# Altium schematic sheet 发送端原理图.SchDoc
size A3
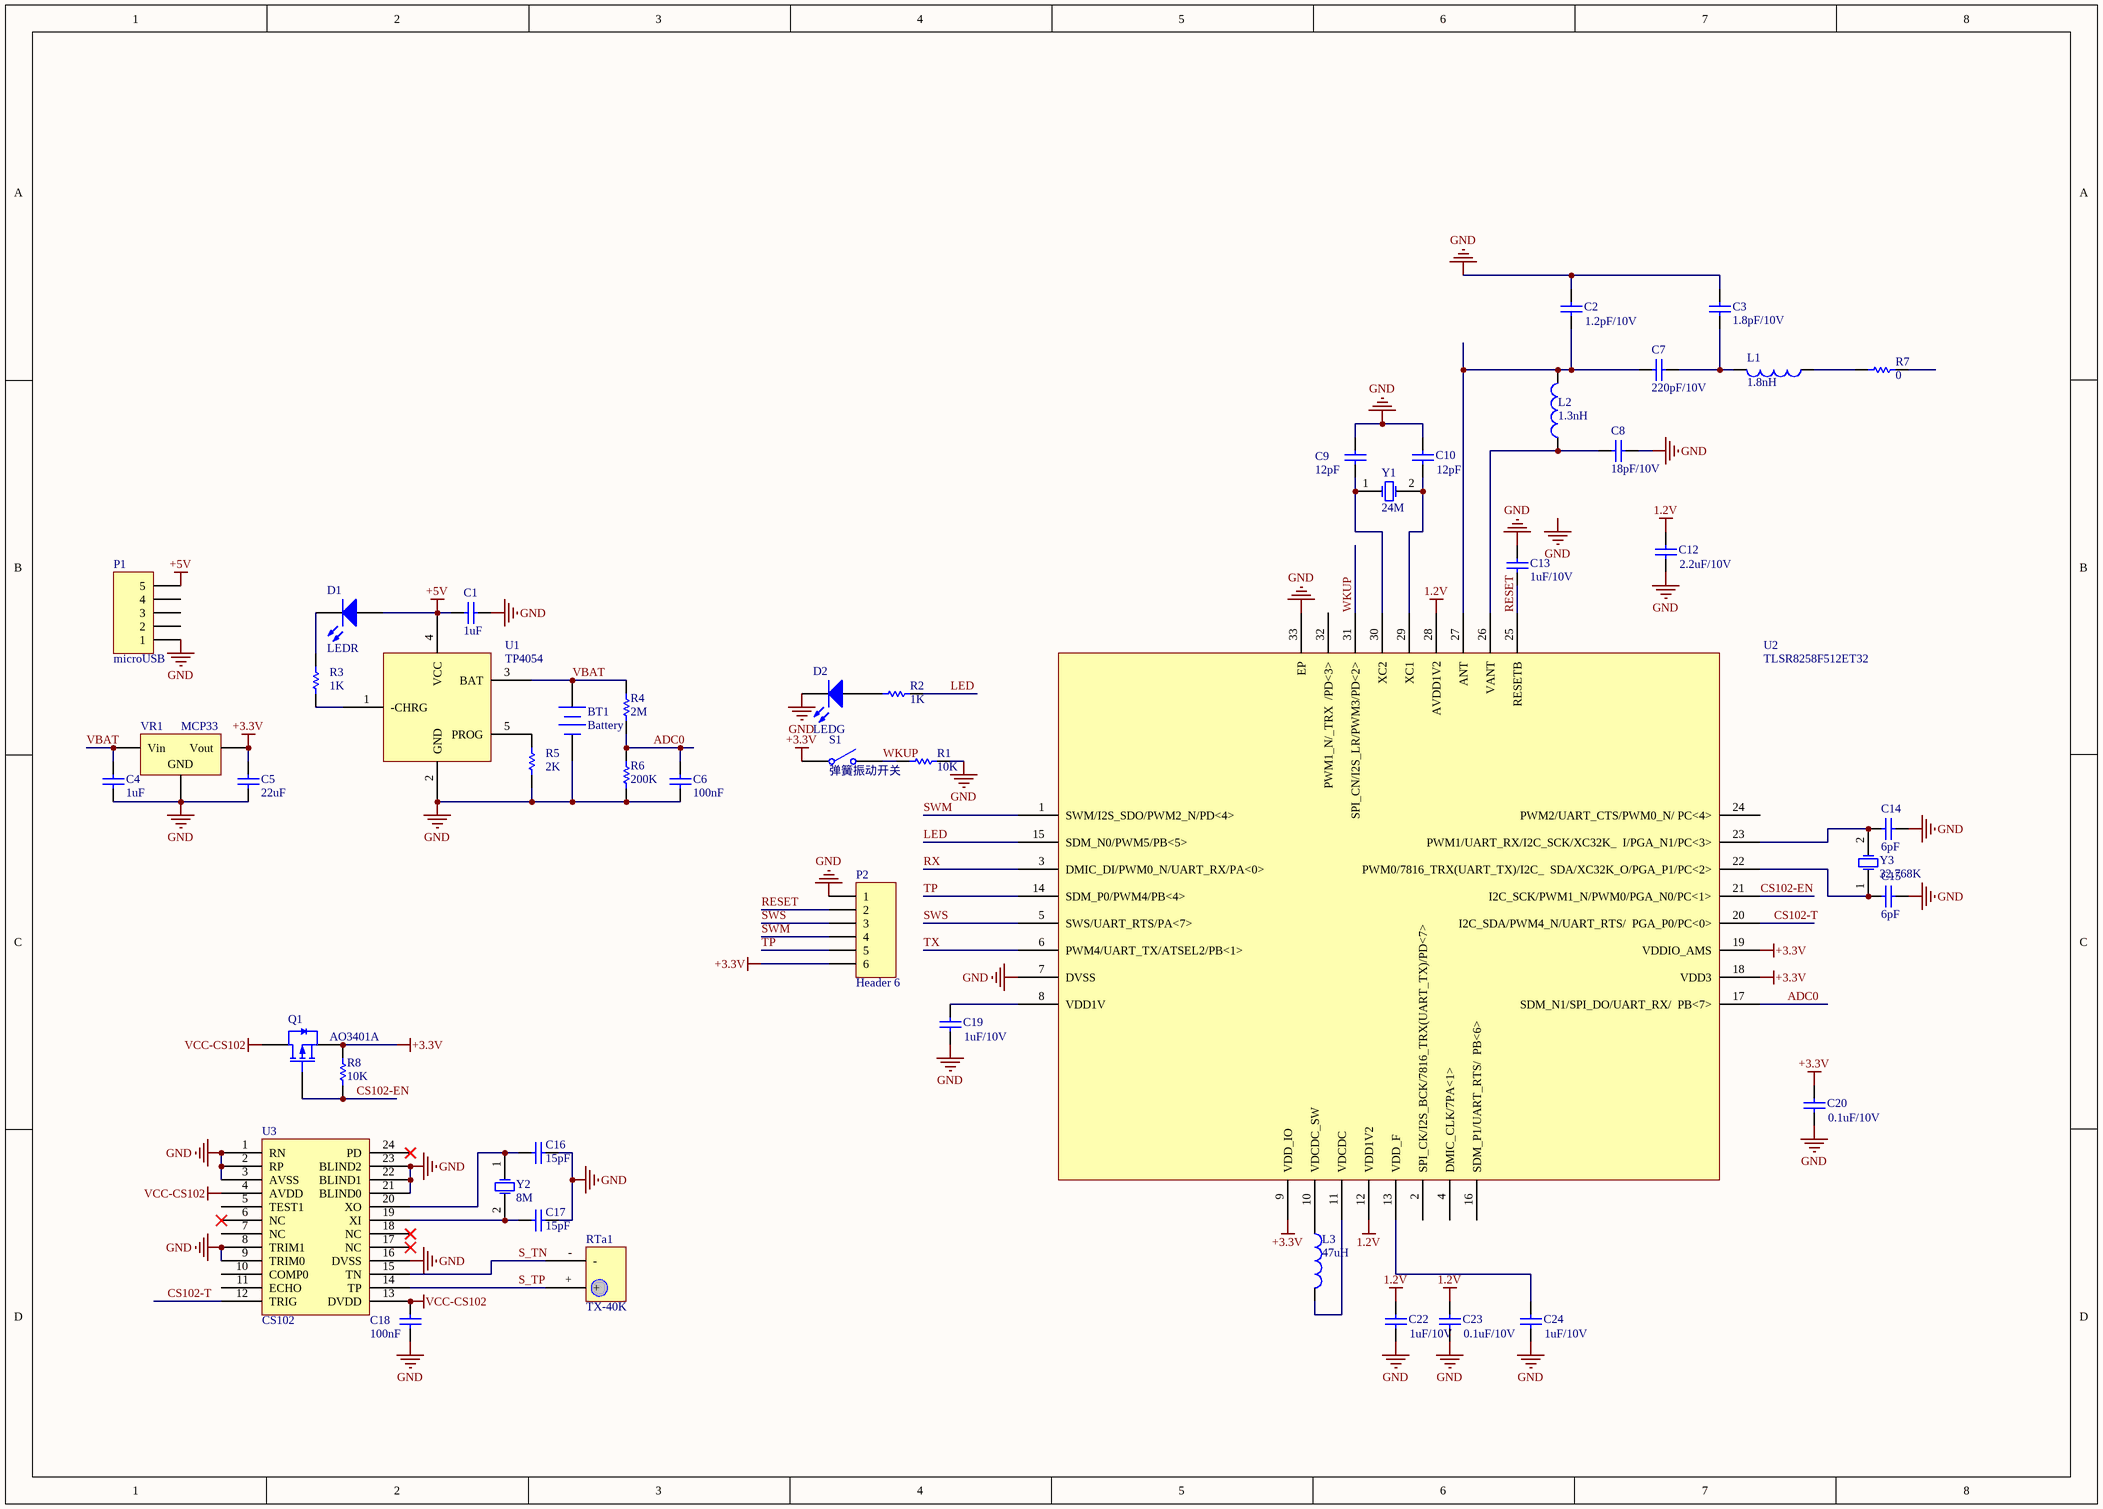
[diagram p0: 发送端原理图.SchDoc]

## Parts
BT1  Battery  [BT]
C1  1uF  [0402]
C2  1.2pF/10V  [0402]
C3  1.8pF/10V  [0402]
C4  1uF  [0402]
C5  22uF  [0603]
C6  100nF  [0402]
C7  220pF/10V  [0402]
C8  18pF/10V  [0402]
C9  12pF  [0402]
C10  12pF  [0402]
C12  2.2uF/10V  [0402]
C13  1uF/10V  [0402]
C14  6pF  [0402]
C15  6pF  [0402]
C16  15pF  [0402]
C17  15pF  [0402]
C18  100nF  [0402]
C19  1uF/10V  [0402]
C20  0.1uF/10V  [0402]
C22  1uF/10V  [0402]
C23  0.1uF/10V  [0402]
C24  1uF/10V  [0402]
D1  LEDR  [LED0603]
D2  LEDG  [LED0603]
L1  1.8nH  [0402]
L2  1.3nH  [0402]
L3  47uH  [0603R]
P1  microUSB  [MICROUSB]
P2  Header 6  [SIP6-1.27]
Q1  AO3401A  [AO3401]
R1  10K  [0402]
R2  1K  [0402]
R3  1K  [0402]
R4  2M  [0402]
R5  2K  [0402]
R6  200K  [0402]
R7  0  [0402]
R8  10K  [0402]
RTa1  TX-40K  [US-10mm]
S1  弹簧振动开关  [SW]
U1  TP4054  [TP4054]
U2  TLSR8258F512ET32  [QFN-32]
U3  CS102  [TSSOP24]
VR1  MCP33  [MCP33]
Y1  24M  [XTAL4TN_3225]
Y2  8M  [5032]
Y3  32.768K  [XTAL3215]

## Nets
1.2V: C12.2 C22.2 C23.2 U2.12(VDD1V2) U2.28(AVDD1V2)
+3.3V: C5.1 C20.2 P2.6 Q1.2(S) R8.2 S1.1(COMMON) U2.9(VDD_IO) U2.18(VDD3) U2.19(VDDIO_AMS) VR1.3(Vout)
+5V: C1.2 D1.1(A) P1.5 U1.4(VCC)
GND: BT1.2(-) C1.1 C2.2 C3.1 C4.2 C5.2 C6.1 C8.1 C9.2 C10.2 C12.1 C13.1 C14.1 C15.1 C16.2 C17.2 C18.1 C19.1 C20.1 C22.1 C23.1 C24.1 D2.2(K) P1.1 P2.1 R1.1 R5.1 R6.1 U1.2(GND) U2.7(DVSS) U2.33(EP) U3.1(RN) U3.2(RP) U3.3(AVSS) U3.8(TRIM1) U3.9(TRIM0) U3.16(DVSS) U3.21(BLIND0) U3.22(BLIND1) U3.23(BLIND2) VR1.2(GND)
VCC-CS102: C18.2 Q1.3(D) U3.4(AVDD) U3.13(DVDD)
ADC0: C6.2 R4.1 R6.2 U2.17(SDM_N1/SPI_DO/UART_RX/__PB<7>)
CS102-EN: Q1.1(G) R8.1 U2.21(I2C_SCK/PWM1_N/PWM0/PGA_N0/PC<1>)
CS102-T: U2.20(I2C_SDA/PWM4_N/UART_RTS/__PGA_P0/PC<0>) U3.12(TRIG)
LED: R2.1 U2.15(SDM_N0/PWM5/PB<5>)
RESET: C13.2 P2.2 U2.25(RESETB)
RX: U2.3(DMIC_DI/PWM0_N/UART_RX/PA<0>)
S_TN: RTa1.- U3.15(TN)
S_TP: RTa1.+ U3.14(TP)
SWM: P2.4 U2.1(SWM/I2S_SDO/PWM2_N/PD<4>)
SWS: P2.3 U2.5(SWS/UART_RTS/PA<7>)
TP: P2.5 U2.14(SDM_P0/PWM4/PB<4>)
TX: U2.6(PWM4/UART_TX/ATSEL2/PB<1>)
VBAT: BT1.1(+) C4.1 R4.2 U1.3(BAT) VR1.1(Vin)
WKUP: R1.2 S1.2(NO) U2.31(SPI_CN/I2S_LR/PWM3/PD<2>)
NetC2_1: C2.1 C7.2 L2.2 U2.27(ANT)
NetC3_2: C3.2 C7.1 L1.2
NetC8_2: C8.2 L2.1 U2.26(VANT)
NetC9_1: C9.1 U2.30(XC2) Y1.1(OSC1)
NetC10_1: C10.1 U2.29(XC1) Y1.2(OSC2)
NetC14_2: C14.2 U2.23(PWM1/UART_RX/I2C_SCK/XC32K___I/PGA_N1/PC<3>) Y3.2(OSC2)
NetC15_2: C15.2 U2.22(PWM0/7816_TRX(UART_TX)/I2C___SDA/XC32K_O/PGA_P1/PC<2>) Y3.1(OSC1)
NetC16_1: C16.1 U3.20(XO) Y2.1(OSC1)
NetC17_1: C17.1 U3.19(XI) Y2.2(OSC2)
NetC19_2: C19.2 U2.8(VDD1V)
NetC24_2: C24.2 U2.13(VDD_F)
NetD1_2: D1.2(K) R3.2
NetD2_1: D2.1(A) R2.2
NetL1_1: L1.1 R7.2
NetL3_1: L3.1 U2.10(VDCDC_SW)
NetL3_2: L3.2 U2.11(VDCDC)
NetR3_1: R3.1 U1.1(-CHRG)
NetR5_2: R5.2 U1.5(PROG)

Not connected (* = marked no-connect by the designer): P1 2 3 4; R7 1; U2 2(SPI_CK/I2S_BCK/7816_TRX(UART_TX)/PD<7>) 4(DMIC_CLK/7PA<1>) 16(SDM_P1/UART_RTS/__PB<6>) 24(PWM2/UART_CTS/PWM0_N/_PC<4>) 32(PWM1_N/_TRX__/PD<3>); U3 5(TEST1) 6(NC)* 7(NC) 10(COMP0) 11(ECHO) 17(NC)* 18(NC)* 24(PD)*

## Notes on the sheet
- Labels drawn without touching a wire or pin: GND

## Library data of the parts
BT1 = Battery: Multicell Battery; Published: 24-Mar-1999; LatestRevisionDate: 17-Jul-2002; LatestRevisionNote: Re-released for DXP Platform.; PackageReference: BAT-2; Publisher: Altium Limited; PackageDescription: Battery; 2 Leads
C1 C4-C6 C18 = Cap: Capacitor; Value: 100pF; Published: 8-Jun-2000; LatestRevisionDate: 17-Jul-2002; LatestRevisionNote: Re-released for DXP Platform.; PackageReference: RAD-0.3; Publisher: Altium Limited; PackageDescription: Radial Cap, Thru-Hole; 2 Leads; 0.3 in Pin Spacing
C2 C3 C7-C10 C12-C15 C19 C20 C22-C24 = Cap: Capacitor; Value: 15pF; Published: 8-Jun-2000; LatestRevisionDate: 17-Jul-2002; LatestRevisionNote: Re-released for DXP Platform.; PackageReference: RAD-0.3; Publisher: Altium Limited
C16 C17 = Cap: Capacitor; Published: 8-Jun-2000; LatestRevisionDate: 17-Jul-2002; LatestRevisionNote: Re-released for DXP Platform.; PackageReference: RAD-0.3; Publisher: Altium Limited; Value: 15pF
D1 D2 = LED0: Typical INFRARED GaAs LED; Published: 8-Jun-2000; LatestRevisionDate: 08-Jul-2005; LatestRevisionNote: Mech Layer 1 removed.; PackageReference: LED-0; Publisher: Altium Limited; PackageDescription: LED; 2 Leads
L1-L3 = Inductor: Code_IEC: 1005; Value: 10mH; Published: 8-Jun-2000; LatestRevisionDate: 29-May-2009; LatestRevisionNote: IPC-7351 Footprint Added.; PackageReference: 0402-A; Publisher: Altium Limited; PackageDescription: Chip Inductor; Code_JEITA: 0402
P1 = Header 5: Header, 5-Pin; LatestRevisionDate: 17-Jul-2002; LatestRevisionNote: Re-released for DXP Platform.; Publisher: Altium Limited
P2 = Header 6: Header, 6-Pin; LatestRevisionDate: 17-Jul-2002; LatestRevisionNote: Re-released for DXP Platform.; Publisher: Altium Limited
Q1 = AO3401A P道沟 X13A15 SOT-23: MOS(场效应管); ComponentLink1Description: 供应商链接; ComponentLink1URL: http://www.szlcsc.com/product/details_15801.html; Package: SOT-23; Supplier: LC; SuppliersPartNumber: C15127
R1 R4-R8 = Res1: Resistor; Value: 1K; Published: 8-Jun-2000; LatestRevisionDate: 17-Jul-2002; LatestRevisionNote: Re-released for DXP Platform.; PackageReference: AXIAL-0.3; Publisher: Altium Limited; PackageDescription: Axial Device, Thru-Hole; 2 Leads; 0.3 in Pin Spacing
R2 R3 = Res1: Resistor; Published: 8-Jun-2000; LatestRevisionDate: 17-Jul-2002; LatestRevisionNote: Re-released for DXP Platform.; PackageReference: AXIAL-0.3; Publisher: Altium Limited; PackageDescription: Axial Device, Thru-Hole; 2 Leads; 0.3 in Pin Spacing; Value: 1K
RTa1 = TC40K
S1 = SW-SPST: Single-Pole, Single-Throw Switch; Published: 24-Mar-1999; LatestRevisionDate: 17-Jul-2002; LatestRevisionNote: Re-released for DXP Platform.; PackageReference: SPST-2; Publisher: Altium Limited; PackageDescription: Switch; 2 Leads
U3 = CS100
VR1 = Volt Reg: Voltage Regulator; Published: 24-Mar-1999; LatestRevisionDate: 29-May-2009; LatestRevisionNote: IPC-7351 Footprint Added.; PackageReference: D2PAK; Publisher: Altium Limited; PackageDescription: 3-Pin Transistor Outline Package 2.54 mm Pitch, 15.1 mm Lead Span
Y1-Y3 = XTAL: Crystal Oscillator; Published: 8-Jun-2000; LatestRevisionDate: 17-Jul-2002; LatestRevisionNote: Re-released for DXP Platform.; PackageReference: R38; Publisher: Altium Limited